# Altium schematic sheet Transimpedance_Amplifier.SchDoc
size A; SheetNumber: 7; SheetTotal: 9
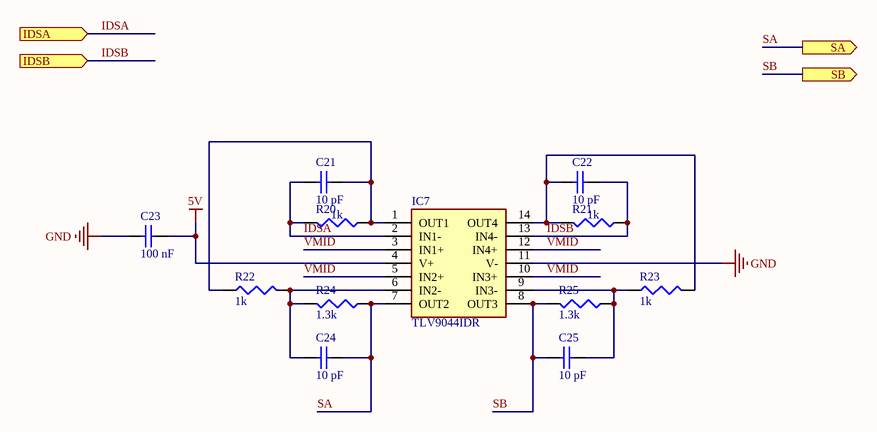
[diagram p0: Transimpedance_Amplifier.SchDoc]

## Parts
C21  10 pF  [1608[0603]]
C22  10 pF  [1608[0603]]
C23  100 nF  [1608[0603]]
C24  10 pF  [1608[0603]]
C25  10 pF  [1608[0603]]
IC7  TLV9044IDR  [SOIC127P600X175-14N]
R20  1k  [J1-0603]
R21  1k  [J1-0603]
R22  1k  [J1-0603]
R23  1k  [J1-0603]
R24  1.3k  [J1-0603]
R25  1.3k  [J1-0603]

## Ports
IDSA (in), IDSB (in), SA (out), SB (out)

## Nets
5V: C23.2 IC7.4(V+)
GND: C23.1 IC7.11(V-)
IDSA: C21.1 IC7.2(IN1-) R20.2 ; port IDSA
IDSB: C22.2 IC7.13(IN4-) R21.1 ; port IDSB
SA: C24.2 IC7.7(OUT2) R24.1 ; port SA
SB: C25.1 IC7.8(OUT3) R25.2 ; port SB
VMID: IC7.3(IN1+) IC7.5(IN2+) IC7.10(IN3+) IC7.12(IN4+)
NetC21_2: C21.2 IC7.1(OUT1) R20.1 R22.1
NetC22_1: C22.1 IC7.14(OUT4) R21.2 R23.2
NetC24_1: C24.1 IC7.6(IN2-) R22.2 R24.2
NetC25_2: C25.2 IC7.9(IN3-) R23.1 R25.1

## Library data of the parts
C21-C25 = Cap Semi: Published: 8-Jun-2000; LatestRevisionDate: 29-May-2009; LatestRevisionNote: IPC-7351 Footprint Added.; PackageReference: C1206; Publisher: Altium Limited; PackageDescription: Chip Capacitor
IC7 = TLV9044IDR: Integrated Circuit; Manufacturer_Name: Texas Instruments; Datasheet Link: https://www.ti.com/lit/gpn/TLV9044; Height: 1.75mm; Manufacturer_Part_Number: TLV9044IDR; Mouser Part Number: 595-TLV9044IDR; Mouser Price/Stock: https://www.mouser.co.uk/ProductDetail/Texas-Instruments/TLV9044IDR?qs=eP2BKZSCXI4HsJGpft0kpw%3D%3D
R20-R25 = Res3: Resistor; Published: 8-Jun-2000; LatestRevisionDate: 29-May-2009; LatestRevisionNote: IPC-7351 Footprint Added.; PackageReference: J1-0603; Publisher: Altium Limited; PackageDescription: Chip Resistor